# Altium schematic sheet Regulators and Buck Converters.SchDoc: RK3399 COB Design V1.0
size A3; Author: ABC; Organization: Altium Limited; Address1: L3, 12a Rodborough Rd; Address2: Frenchs Forest; Address3: NSW; Address4: Australia 2086; DocumentNumber: 15; SheetNumber: 15; SheetTotal: 27; PROJECT CODE: A_V1.0
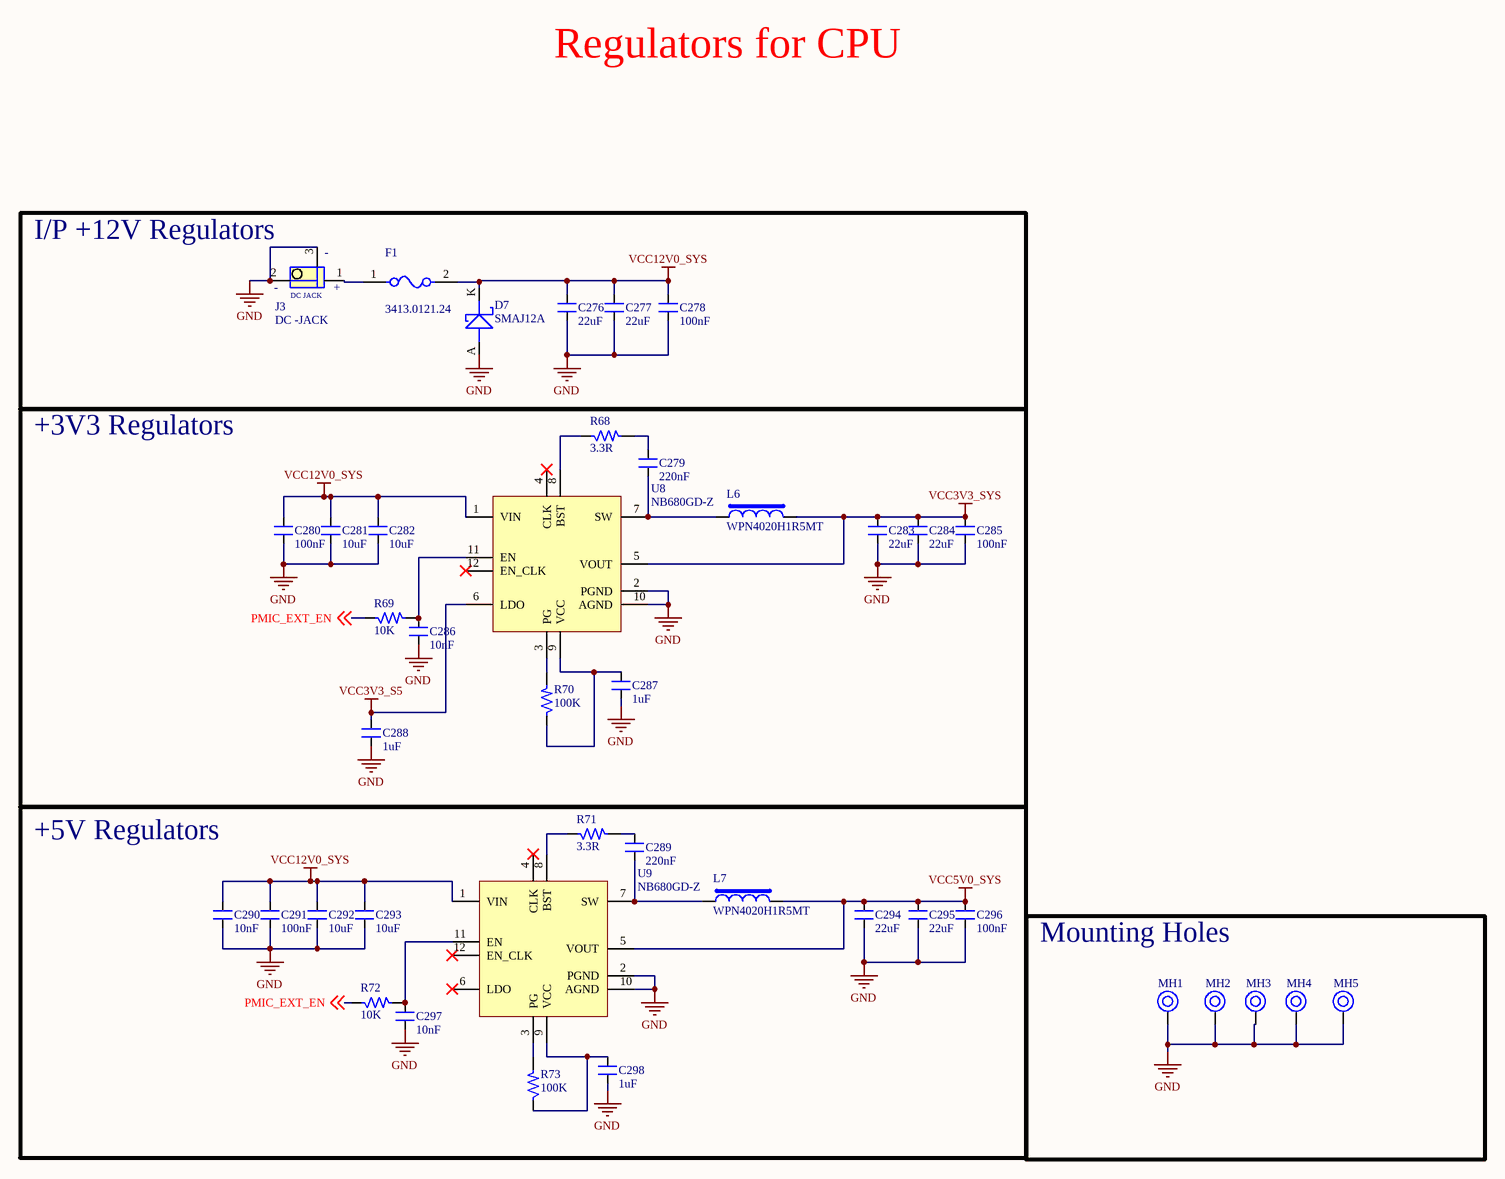
[diagram p0: Regulators and Buck Converters.SchDoc]

## Parts
C276  22uF  [CAP_0805]
C277  22uF  [CAP_0805]
C278  100nF  [CAP_0805]
C279  220nF  [CAP_0603]
C280  100nF  [CAP_0805]
C281  10uF  [CAP_0805]
C282  10uF  [CAP_0805]
C283  22uF  [CAP_0805]
C284  22uF  [CAP_0805]
C285  100nF  [CAP_0603]
C286  10nF  [CAP_0603]
C287  1uF  [CAP_0603]
C288  1uF  [CAP_0603]
C289  220nF  [CAP_0603]
C290  10nF  [CAP_0603]
C291  100nF  [CAP_0805]
C292  10uF  [CAP_0805]
C293  10uF  [CAP_0805]
C294  22uF  [CAP_0805]
C295  22uF  [CAP_0805]
C296  100nF  [CAP_0603]
C297  10nF  [CAP_0603]
C298  1uF  [CAP_0603]
D7  SMAJ12A  [DIO_SMA_DO-214AC]
F1  3413.0121.24  [RES_1206]
J3  DC -JACK  [CON3_129_PJ-002A_TH_RA]
L6  WPN4020H1R5MT  [IND_1616]
L7  WPN4020H1R5MT  [IND_1616]
MH1  Mounting Hole  [MOUNTING]  (value not drawn)  (no BOM)
MH2  Mounting Hole  [MOUNTING]  (value not drawn)  (no BOM)
MH3  Mounting Hole  [MOUNTING]  (value not drawn)  (no BOM)
MH4  Mounting Hole  [MOUNTING]  (value not drawn)  (no BOM)
MH5  Mounting Hole  [MOUNTING]  (value not drawn)  (no BOM)
R68  3.3R  [RES_0603]
R69  10K  [RES_0603]
R70  100K  [RES_0603]
R71  3.3R  [RES_0603]
R72  10K  [RES_0603]
R73  100K  [RES_0603]
U8  NB680GD-Z  [QFN-12_19_118X118_SMD]
U9  NB680GD-Z  [QFN-12_19_118X118_SMD]

## Blocks framed on the sheet
I/P +12V Regulators: C276-C278 D7 F1 J3
+3V3 Regulators: C279-C288 L6 R68-R70 U8
+5V Regulators: C289-C298 L7 R71-R73 U9
Mounting Holes: MH1-MH5

## Nets
GND: C276.1 C277.1 C278.1 C280.1 C281.1 C282.1 C283.1 C284.1 C285.1 C286.1 C287.1 C288.1 C290.1 C291.1 C292.1 C293.1 C294.1 C295.1 C296.1 C297.1 C298.1 D7.A J3.2 J3.3(-) MH1.1 MH2.1 MH3.1 MH4.1 MH5.1 U8.2(PGND) U8.10(AGND) U9.2(PGND) U9.10(AGND)
VCC3V3_S5: C288.2 U8.6(LDO)
VCC3V3_SYS: C283.2 C284.2 C285.2 L6.2 U8.5(VOUT)
VCC5V0_SYS: C294.2 C295.2 C296.2 L7.2 U9.5(VOUT)
VCC12V0_SYS: C276.2 C277.2 C278.2 C280.2 C281.2 C282.2 C290.2 C291.2 C292.2 C293.2 D7.K F1.2 U8.1(VIN) U9.1(VIN)
PMIC_EXT_EN: R69.1 R72.1 ; off-sheet PMIC_EXT_EN
NetC279_1: C279.1 L6.1 U8.7(SW)
NetC279_2: C279.2 R68.2
NetC286_2: C286.2 R69.2 U8.11(EN)
NetC287_2: C287.2 R70.1 U8.9(VCC)
NetC289_1: C289.1 L7.1 U9.7(SW)
NetC289_2: C289.2 R71.2
NetC297_2: C297.2 R72.2 U9.11(EN)
NetC298_2: C298.2 R73.1 U9.9(VCC)
NetF1_1: F1.1 J3.1
NetR68_1: R68.1 U8.8(BST)
NetR70_2: R70.2 U8.3(PG)
NetR71_1: R71.1 U9.8(BST)
NetR73_2: R73.2 U9.3(PG)

Not connected (* = marked no-connect by the designer): U8 4(CLK)* 12(EN_CLK)*; U9 4(CLK)* 6(LDO)* 12(EN_CLK)*

## Notes on the sheet
- Regulators for CPU
- TITLE:
- DOCUMENT NAME:
- SCALE 1:1
- This document is copyright of Esteempcb and shall not be revealed, produced, copied, in whole or in part, nor
- PROJECT CODE:
- TEMPLATE:
- A3
- AUTHOR:
- Sheet
- of
- used for any purpose other than submitted.
- (in symbol CON-PLG_3X1-228-DC_JACK) +; DC JACK

## Library data of the parts
C276 C277 C283 C284 C294 C295 = CAP_22uF-25V-20%-0805: 22µF ±20% 25V Ceramic Capacitor X5R 0805 (2012 Metric) /; Manufacturer: Murata Electronics; Manufacturer Part Number: GRM21BR61E226ME44K; Case/Package: 0805; Supplier-1: Digikey
C278 C280 C291 = CAP_100nF-25V-10%-0805: 0.1µF ±10% 25V Ceramic Capacitor X7R 0805 (2012 Metric) /; Manufacturer: Yageo; Manufacturer Part Number: CC0805KRX7R8BB104; Case/Package: 0805; Supplier-1: Digikey
C279 C289 = CAP_220nF-10V-10%-0603: 0.22µF ±10% 10V Ceramic Capacitor X7R 0603 (1608 Metric) /; Manufacturer: Yageo; Manufacturer Part Number: CC0603KRX7R6BB224; Case/Package: 0603; Supplier-1: Digikey
C281 C282 C292 C293 = CAP_10uF-25V-10%-0805: 10µF ±10% 25V Ceramic Capacitor X5R 0805 (2012 Metric) /; Manufacturer: Murata Electronics; Manufacturer Part Number: GRM21BR61E106KA73K; Case/Package: 0805; Supplier-1: Digikey
C285 C296 = CAP_100nF-10V-5%-0603: 0.1µF ±10% 10V Ceramic Capacitor X7R 0603 (1608 Metric) /; Manufacturer: Yageo; Manufacturer Part Number: CC0603KRX7R6BB104; Case/Package: 0603; Supplier-1: Digikey
C286 C290 C297 = CAP_10nF-10V-10%-0603: 10000pF ±10% 10V Ceramic Capacitor X7R 0603 (1608 Metric) /; Manufacturer: KEMET; Manufacturer Part Number: C0603C103K8RACTU; Case/Package: 0603; Supplier-1: Digikey
C287 C288 C298 = CAP_1uF-10V-5%-0603: 1µF ±10% 10V Ceramic Capacitor X5R 0603 (1608 Metric) /; Manufacturer: Samsung Electro-Mechanics; Manufacturer Part Number: CL10A105KP8NNNC; Case/Package: 0603; Supplier-1: Digikey
D7 = DIO-T_13.3V-19.9V-20.1A-DO-214AC: 19.9V Clamp 20.1A Ipp Tvs Diode Surface Mount DO-214AC (SMA); Manufacturer: Littelfuse Inc.; Manufacturer Part Number: SMAJ12A; Case/Package: DO-214AC; Supplier-1: Digikey
F1 = FUSE_3A-32V-1206: 3A 32V AC 63V DC Fuse Board Mount (Cartridge Style Excluded) Surface Mount 1206 (3216 Metric); Manufacturer: Schurter Inc.; Manufacturer Part Number: 3413.0121.24; Case/Package: 1206; Supplier-1: Digikey
J3 = CON-PLG_3X1-228-DC_JACK: 3 Pins, 1 Row 228mil Pitch, right angle Connector, male; Manufacturer: JST; Manufacturer Part Number: PJ-002A; Case/Package: TH-CON; Supplier-1: SP ROAD
L6 L7 = IND_1.5uH-6A-20%-SMD: Wire Wound SMD Power Inductors – WPN Series / Operating Temp. : -40℃~+125℃ (Including self-heating) /; Manufacturer: Sunlord; Mnaufcaturer Part Number: WPN4020H1R5MT; Case/Package: SMD; Supplier-1: NA
MH1-MH5 = MH_3.5H_6D: Manufacturer Part Number: NA; Case/Package: TH; Manufacturer: NA; Supplier-1: NA
R68 R71 = RES_3.3R-0.1W-1%-0603: 3.3 Ohms ±1% 0.1W, 1/10W Chip Resistor 0603 (1608 Metric) Automotive AEC-Q200, Current Sense Thick Film /; Manufacturer: Panasonic Electronic Components; Manufacturer Part Number: ERJ-3RQF3R3V; Case/Package: 0603; Supplier-1: Digikey
R69 R72 = RES_10K-0.1W-1%-0603: 10 kOhms ±1% 0.1W, 1/10W Chip Resistor 0603 (1608 Metric) Thick Film /; Manufacturer: Yageo; Manufacturer Part Number: RC0603FR-0710KL; Case/Package: 0603; Supplier-1: Digikey
R70 R73 = RES_100K-0.1W-1%-0603: 100 kOhms ±1% 0.1W, 1/10W Chip Resistor 0603 (1608 Metric) Automotive AEC-Q200 Thick Film /; Manufacturer: tackpole Electronics Inc; Manufacturer Part Number: RMCF0603FT100K; Case/Package: 0603; Supplier-1: Digikey
U8 U9 = REG_3.3V-26V-8A-QFN-12: Switching Voltage Regulators 26V Fixed 3.3 V-8A Sync Buck Converter; Manufacturer: Monolithic Power Systems (MPS); Manufacturer Part Number: NB680GD-Z; Case/Package: QFN-12; Supplier-1: Mouser